# Altium project LC_FILTER.PrjPCB
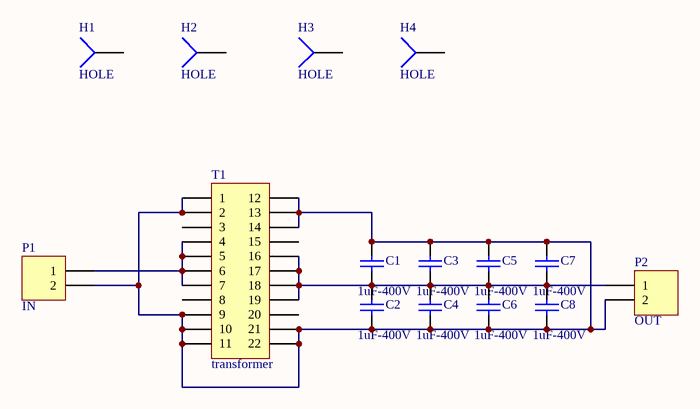
[diagram p0: sche_LC_FILTER.SchDoc]
1 sheet, 15 parts. Net scope: global (net labels, ports and power ports of the same name join across sheets).
Board file: PCB_LC_FILTER.PcbDoc

## Sheet sche_LC_FILTER.SchDoc
size A4

### Parts
C1  value 1uF-400V  [TU]  (hidden comment: Cap)
C2  value 1uF-400V  [TU]  (hidden comment: Cap)
C3  value 1uF-400V  [TU]  (hidden comment: Cap)
C4  value 1uF-400V  [TU]  (hidden comment: Cap)
C5  value 1uF-400V  [TU]  (hidden comment: Cap)
C6  value 1uF-400V  [TU]  (hidden comment: Cap)
C7  value 1uF-400V  [TU]  (hidden comment: Cap)
C8  value 1uF-400V  [TU]  (hidden comment: Cap)
H1  HOLE  [HOLE]
H2  HOLE  [HOLE]
H3  HOLE  [HOLE]
H4  HOLE  [HOLE]
P1  IN  [CONNECTOR2]
P2  OUT  [CONNECTOR2]
T1  transformer  [PCBComponent_1]

### Nets
NetC1_1: C1.1 C2.2 C3.1 C4.2 C5.1 C6.2 C7.1 C8.2 P2.1 T1.16 T1.17 T1.18 T1.19
NetC1_2: C1.2 C2.1 C3.2 C4.1 C5.2 C6.1 C7.2 C8.1 P1.2 P2.2 T1.1 T1.2 T1.9 T1.10 T1.11 T1.12 T1.13 T1.14 T1.21 T1.22
NetP1_1: P1.1 T1.4 T1.5 T1.6 T1.7

Not connected (* = marked no-connect by the designer): H1 1; H2 1; H3 1; H4 1; T1 3 8 15 20

### Library data of the parts
C1-C8 = Cap: Capacitor; Published: 8-Jun-2000; LatestRevisionDate: 17-Jul-2002; LatestRevisionNote: Re-released for DXP Platform.; PackageReference: RAD-0.3; Publisher: Altium Limited
H1-H4 = Socket: LatestRevisionDate: 17-Jul-2002; LatestRevisionNote: Re-released for DXP Platform.; Publisher: Altium Limited
P1 P2 = Header 2: Header, 2-Pin; LatestRevisionDate: 17-Jul-2002; LatestRevisionNote: Re-released for DXP Platform.; Publisher: Altium Limited
T1 = Header 11X2A: Header, 11-Pin, Dual row; LatestRevisionDate: 17-Jul-2002; LatestRevisionNote: Re-released for DXP Platform.; Publisher: Altium Limited